# Altium schematic sheet bat_i.SchDoc
size A4
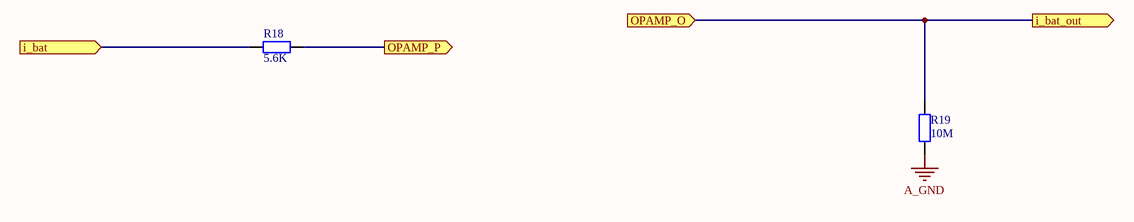
[diagram p0: bat_i.SchDoc]

## Parts
R18  5.6K
R19  10M

## Ports
i_bat (in), i_bat_out (out), OPAMP_O (in), OPAMP_P (out)

## Nets
A_GND: R19.2
i_bat: R18.2 ; port i_bat
i_bat_out: R19.1 ; port i_bat_out, port OPAMP_O
OPAMP_P: R18.1 ; port OPAMP_P

## Library data of the parts
R18 R19 = Resistor: Value: *